# EAGLE design MicroUSB (EAGLE 8.1.0)
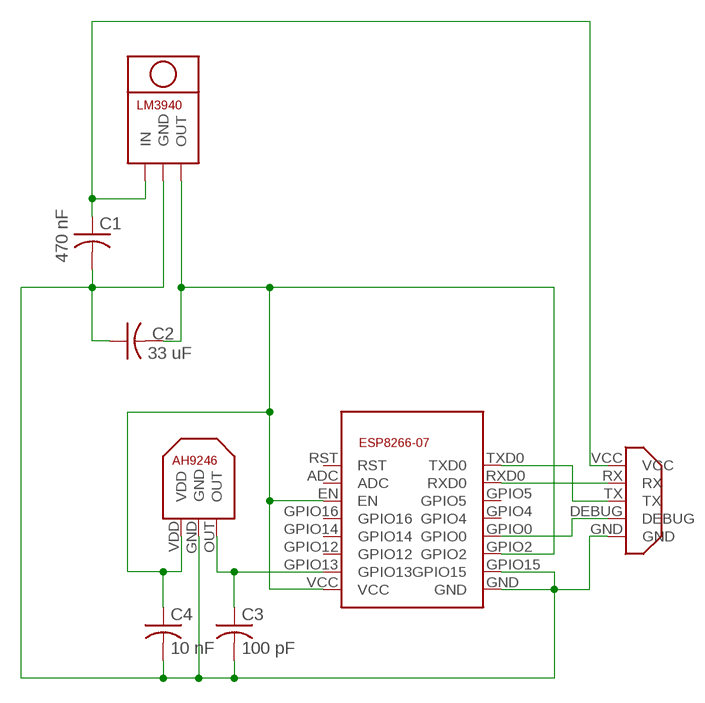
[diagram p0: schematic, sheet 1]

## Parts
C1  470 nF  C-US025-050X050  [C025-050X050]
C2  33 uF  C-US025-050X050  [C025-050X050]
C3  100 pF  C-US025-050X050  [C025-050X050]
C4  10 nF  C-US025-050X050  [C025-050X050]
U$1  ESP8266-07  [ESP8266-07]
U$2  LM3940  [LM3940]
U$3  AH9246  [AH9246]
U$4  MICROUSB  [MICROUSB]

## Nets
N$1: C3.1 U$1.GPIO13 U$3.OUT
N$3: C2.2 C4.1 U$1.EN U$1.GPIO2 U$1.VCC U$2.OUT U$3.VDD
N$4: C1.1 U$2.IN U$4.VCC
N$5: C1.2 C2.1 C3.2 C4.2 U$1.GND U$1.GPIO15 U$2.GND U$3.GND U$4.GND
N$7: U$1.TXD0 U$4.TX
N$8: U$1.RXD0 U$4.RX
N$9: U$1.GPIO0 U$4.DEBUG
Unconnected: U$1.ADC U$1.GPIO4 U$1.GPIO5 U$1.GPIO12 U$1.GPIO14 U$1.GPIO16 U$1.RST

## Library data of the parts
C1-C4 = rcl:C-US: CAPACITOR, American symbol
U$1 = IoT:ESP8266-07
U$2 = IoT:LM3940
U$3 = IoT:AH9246
U$4 = IoT:MICROUSB

## Board
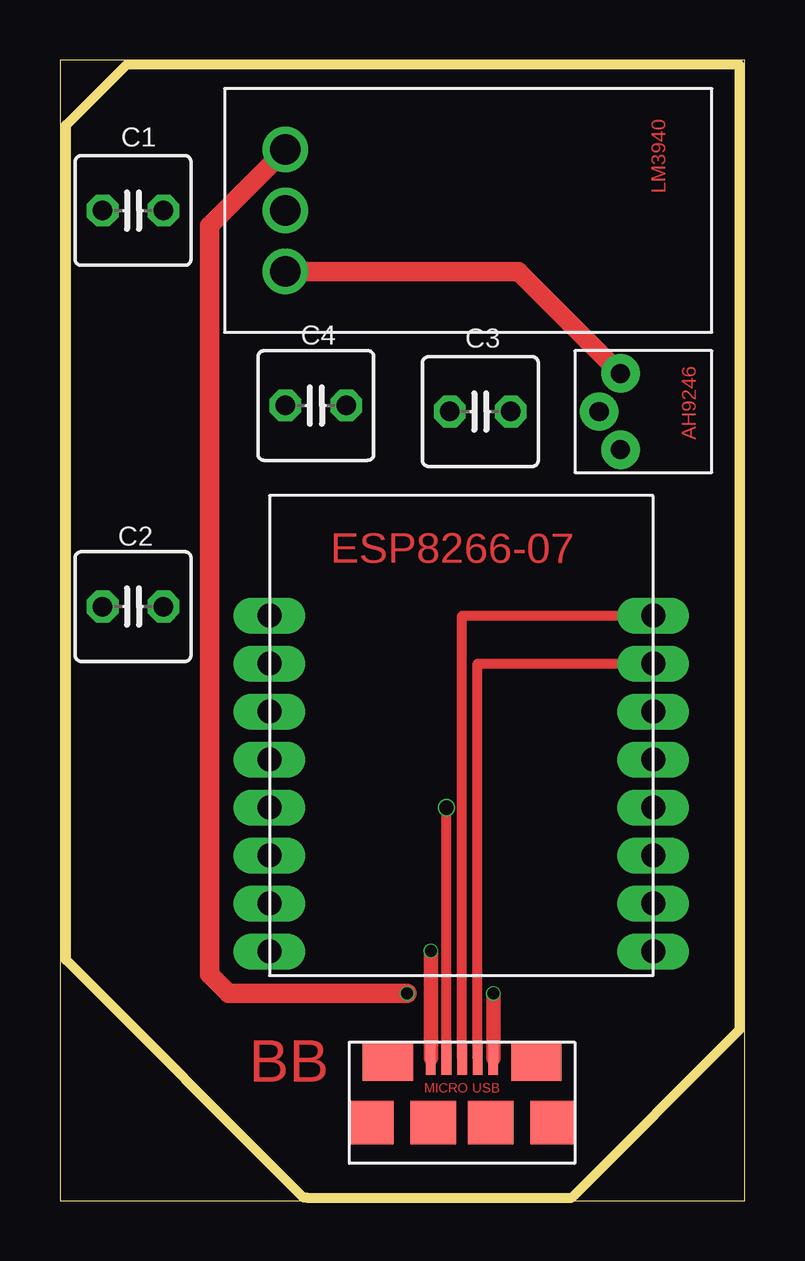
[diagram p1: board, top side]
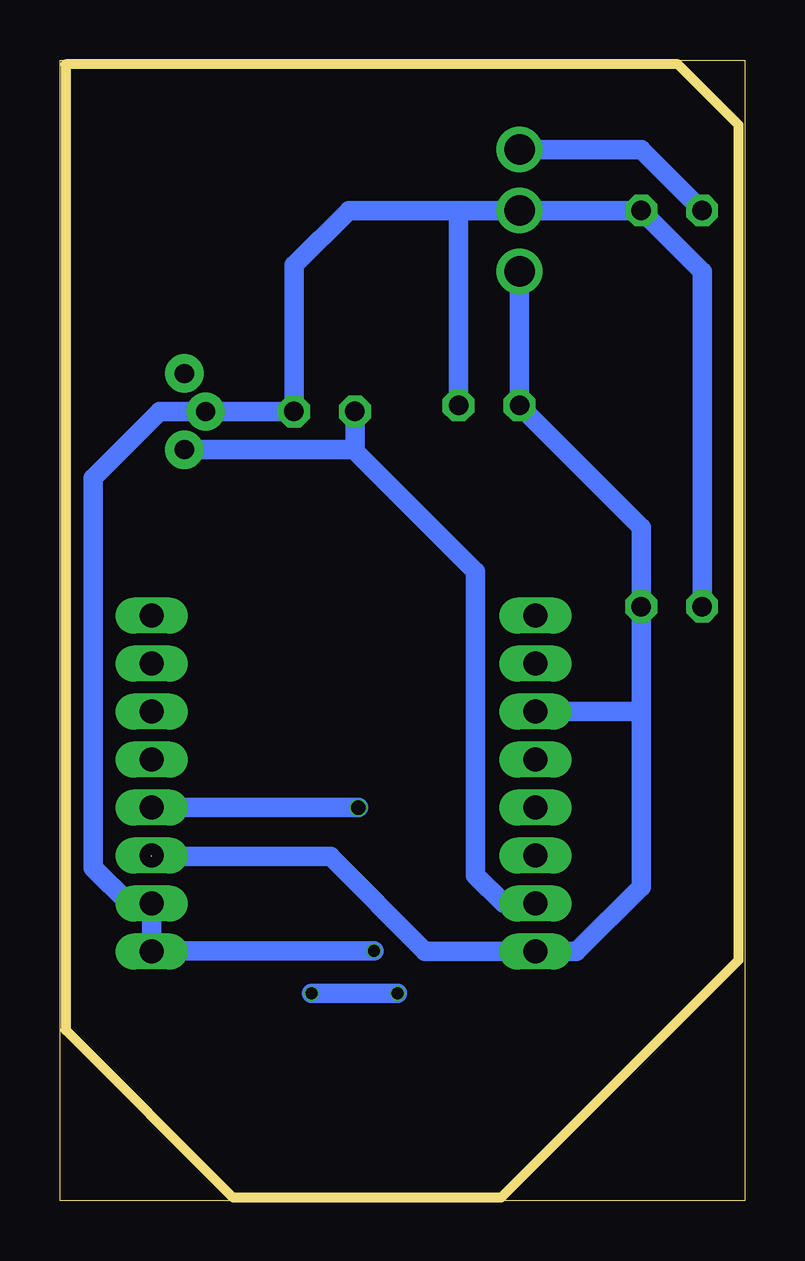
[diagram p2: board, bottom side, seen from below]

Size 28.55 x 47.55 mm. Coordinates in mm from the lower left corner, seen from the top.
Outline: 10.16,0.13 0.25,10.03 0.25,44.83 2.79,47.37 28.32,47.37 28.32,7.11 21.34,0.13 10.29,0.13
Outline: 0,0 28.55,0 28.55,47.55 0,47.55 0,0
Copper layers (1*16): Top 0.035mm / dielectric 1.5mm / Bottom 0.035mm
Design rules "DRC *": minimum track width 10mil, minimum drill 24mil, track to track 8mil, track to pad 8mil, pad to pad 8mil, via to via 8mil, smd to smd 8mil, copper to edge 0mil, drill to drill 0mil, minimum pad ring 10mil, minimum via ring 0mil, stop-mask expansion 10mil, vias tented up to drill 0mil, thermal gap 10mil

### Footprints (pad centres in the part's own frame; a part is rotated, then mirrored left to right if it is on the bottom)
C025-050X050 = drill 0.813 octagon: 1 -1.27,0; 2 1.27,0
ESP8266-07 = drill 1 pad 1.2 long: ADC -6,6; EN -6,4; GND 10,-6; GPIO0 10,0; GPIO2 10,-2; GPIO4 10,2; GPIO5 10,4; GPIO12 -6,-2; GPIO13 -6,-4; GPIO14 -6,0; GPIO15 10,-4; GPIO16 -6,2; RST -6,8; RXD0 10,6; TXD0 10,8; VCC -6,-6
LM3940 = drill 1.27 pad 1.905: GND 0,0; IN -2.54,0; OUT 2.54,0
AH9246 = drill 0.8 pad 1.6: GND 0,-0.885; OUT 1.587,0; VDD -1.587,0
MICROUSB = smd 0.4 x 1.35: DEBUG 0.65,0.675; GND 1.3,0.675; RX -0.65,0.675; TX 0,0.675; VCC -1.3,0.675 | smd 2.1 x 1.6: P$1 3.1,0.8; P$6 -3.1,0.8 | smd 1.9 x 1.8: P$2 3.8,3.35; P$3 -3.8,3.35; P$5 -1.2,3.35; P$7 1.2,3.35

### Placement (x,y rotation side)
C1  3.05,41.27 0 top
C2  3.05,24.77 0 top
C3  17.53,32.89 0 top
C4  10.67,33.15 0 top
U$1  14.73,16.38 0 top
U$2  9.4,41.27 270 top
U$3  23.37,32.89 270 top
U$4  16.76,6.6 180 top

### Tracks (layer width: path | path; a pad name or v marks a point on that pad's centre or on a via)
N$1
  Bottom 0.813: U$1.GPIO13 10.05,12.38 11.23,13.56 11.23,26.22 16.26,31.24 16.26,31.3 | 16.26,31.3 U$3.OUT | 16.26,31.3 C3.1
N$3  (1 unrouted)
  Top 0.813: U$2.OUT 19.11,38.73 U$3.VDD
  Bottom 0.406: 8.73,10.45 U$1.VCC
  Bottom 0.813: 4.32,20.38 4.32,13.08 7.02,10.38 U$1.VCC 13.34,10.38 17.27,14.35 24.73,14.35 | 4.32,20.38 C2.2 4.32,28.07 C4.1 U$2.OUT | U$1.EN 4.32,20.38
N$4  (via drill 0.5)
  Top 0.61: U$4.VCC v18.06,8.64
  Top 0.813: v14.48,8.64 7.04,8.64 6.23,9.44 6.23,40.65 U$2.IN
  Bottom 0.813: C1.1 4.32,43.81 U$2.IN | v18.06,8.64 v14.48,8.64
N$5  (via drill 0.5 pad 0.05)
  Top 0.61: U$4.GND v15.46,10.41
  Bottom 0.406: U$1.GND 24.73,10.41
  Bottom 0.61: 11.94,41.02 11.68,41.27
  Bottom 0.813: C2.1 1.78,38.73 C1.2 U$2.GND 11.68,41.27 16.51,41.27 18.8,38.99 C3.2 U$3.GND 24.41,32.89 27.18,30.12 27.18,13.88 25.68,12.38 U$1.GPIO15 U$1.GND | C4.2 11.94,41.02 | v15.46,10.41 24.73,10.41
N$7
  Top 0.406: U$4.TX 16.76,24.38 U$1.TXD0
N$8
  Top 0.406: U$1.RXD0 17.41,22.38 U$4.RX
N$9  (via drill 0.6)
  Top 0.406: U$4.DEBUG v16.11,16.38
  Bottom 0.813: v16.11,16.38 U$1.GPIO0

### Text on the board
Top: BB